# EAGLE design FAL6567f (EAGLE 7.2.0)
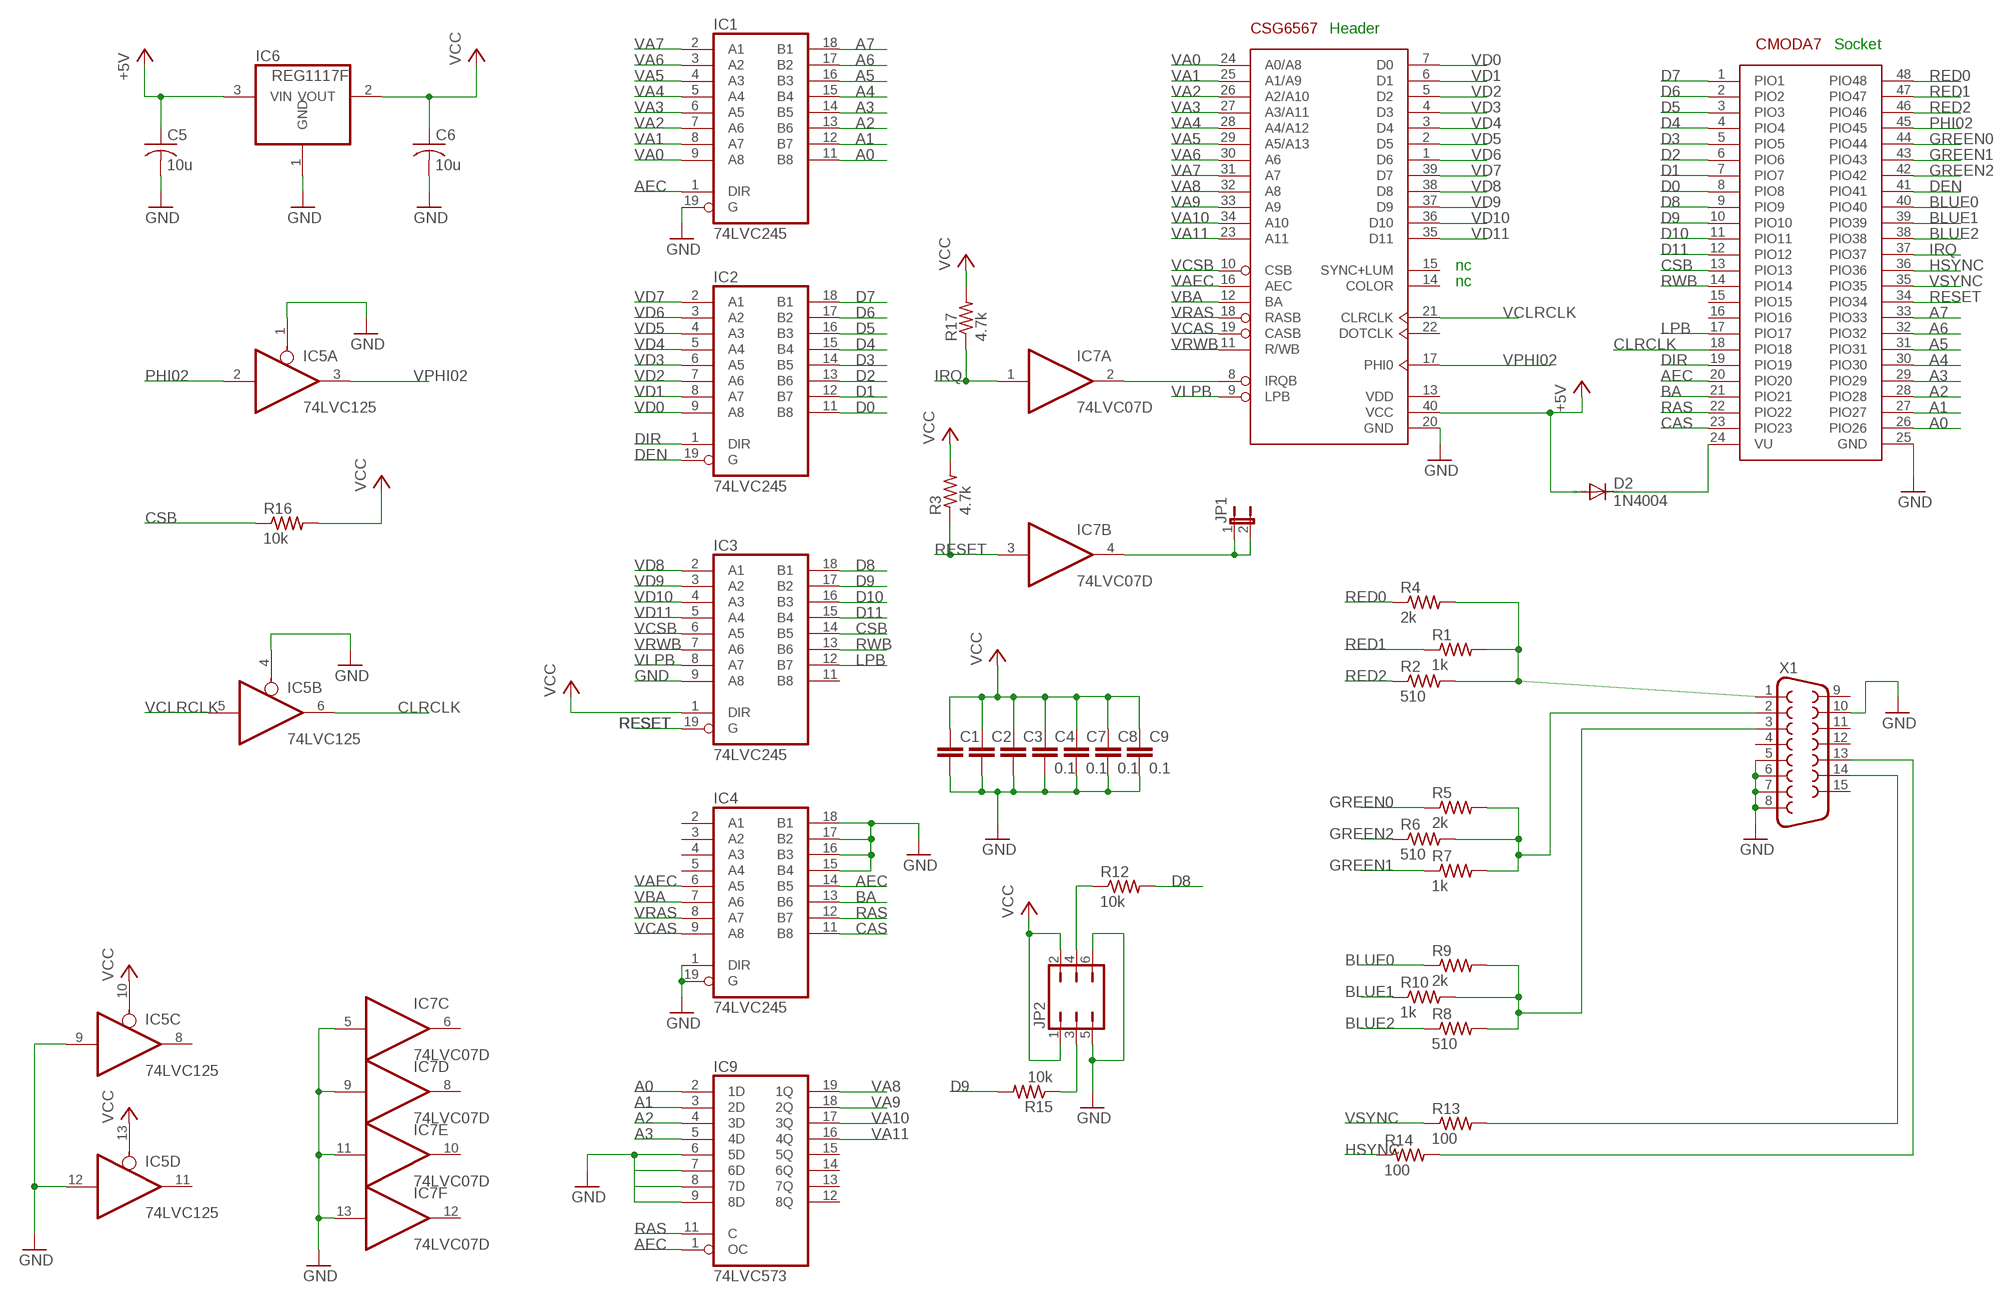
[diagram p0: schematic, sheet 1]

## Parts
C1  C-EU050-024X044  [C050-024X044]
C2  C-EU050-024X044  [C050-024X044]
C3  C-EU050-024X044  [C050-024X044]
C4  0.1  C-EU050-024X044  [C050-024X044]
C5  10u  C-USC1206  [C1206]
C6  10u  C-USC1206  [C1206]
C7  0.1  C-EU050-024X044  [C050-024X044]
C8  0.1  C-EU050-024X044  [C050-024X044]
C9  0.1  C-EU050-024X044  [C050-024X044]
D2  1N4004  [DO41-10]
IC1  74LVC245  74LS245DW  [SO20W]
IC2  74LVC245  74LS245DW  [SO20W]
IC3  74LVC245  74LS245DW  [SO20W]
IC4  74LVC245  74LS245DW  [SO20W]
IC5  74LVC125  [SO14]
IC6  REG1117F  [DD-3]
IC7  74LVC07D  74LS07D  [SO14]
IC9  74LVC573  [SO20W]
JP1  JP1E  [JP1]
JP2  JP3Q  [JP3Q]
R1  1k  R-US_0204/7  [0204/7]
R2  510  R-US_0204/7  [0204/7]
R3  4.7k  R-US_0204/7  [0204/7]
R4  2k  R-US_0204/7  [0204/7]
R5  2k  R-US_0204/7  [0204/7]
R6  510  R-US_0204/7  [0204/7]
R7  1k  R-US_0204/7  [0204/7]
R8  510  R-US_0204/7  [0204/7]
R9  2k  R-US_0204/7  [0204/7]
R10  1k  R-US_0204/7  [0204/7]
R12  10k  R-US_0204/7  [0204/7]
R13  100  R-US_0204/7  [0204/7]
R14  100  R-US_0204/7  [0204/7]
R15  10k  R-US_0204/7  [0204/7]
R16  10k  R-US_0204/7  [0204/7]
R17  4.7k  R-US_0204/7  [0204/7]
U$1  CSG6567  [DIP-40]
U$2  CMODA7  [DIL48]
X1  F15HDV  [HDF15V]

## Nets
+5V: C5.1 D2.A IC6.3(VIN) U$1.40(VCC)
A0: IC1.11(B8) IC9.2(1D) U$2.26(PIO26)
A1: IC1.12(B7) IC9.3(2D) U$2.27(PIO27)
A2: IC1.13(B6) IC9.4(3D) U$2.28(PIO28)
A3: IC1.14(B5) IC9.5(4D) U$2.29(PIO29)
A4: IC1.15(B4) U$2.30(PIO30)
A5: IC1.16(B3) U$2.31(PIO31)
A6: IC1.17(B2) U$2.32(PIO32)
A7: IC1.18(B1) U$2.33(PIO33)
AEC: IC1.1(DIR) IC4.14(B5) IC9.1(OC) U$2.20(PIO20)
BA: IC4.13(B6) U$2.21(PIO21)
BLUE0: R9.1 U$2.40(PIO40)
BLUE1: R10.1 U$2.39(PIO39)
BLUE2: R8.1 U$2.38(PIO38)
CAS: IC4.11(B8) U$2.23(PIO23)
CLRCLK: IC5.6(B:O) U$2.18(PIO18)
CSB: IC3.14(B5) R16.1 U$2.13(PIO13)
D0: IC2.11(B8) U$2.8(PIO8)
D1: IC2.12(B7) U$2.7(PIO7)
D2: IC2.13(B6) U$2.6(PIO6)
D3: IC2.14(B5) U$2.5(PIO5)
D4: IC2.15(B4) U$2.4(PIO4)
D5: IC2.16(B3) U$2.3(PIO3)
D6: IC2.17(B2) U$2.2(PIO2)
D7: IC2.18(B1) U$2.1(PIO1)
D8: IC3.18(B1) R12.2 U$2.9(PIO9)
D9: IC3.17(B2) R15.2 U$2.10(PIO10)
D10: IC3.16(B3) U$2.11(PIO11)
D11: IC3.15(B4) U$2.12(PIO12)
DEN: IC2.19(G) U$2.41(PIO41)
DIR: IC2.1(DIR) U$2.19(PIO19)
GND: C1.2 C2.2 C3.2 C4.2 C5.2 C6.2 C7.2 C8.2 C9.2 IC1.19(G) IC3.9(A8) IC4.1(DIR) IC4.15(B4) IC4.16(B3) IC4.17(B2) IC4.18(B1) IC4.19(G) IC5.1(A:OE) IC5.4(B:OE) IC5.9(C:I) IC5.12(D:I) IC6.1(GND) IC7.5(C:I) IC7.9(D:I) IC7.11(E:I) IC7.13(F:I) IC9.6(5D) IC9.9(8D) JP2.5 JP2.6 U$1.20(GND) U$2.25(GND) X1.5 X1.6 X1.7 X1.8 X1.10
GREEN0: R5.1 U$2.44(PIO44)
GREEN1: R7.1 U$2.43(PIO43)
GREEN2: R6.1 U$2.42(PIO42)
HSYNC: R14.1 U$2.36(PIO36)
IRQ: IC7.1(A:I) R17.1 U$2.37(PIO37)
LPB: IC3.12(B7) U$2.17(PIO17)
MD0: JP2.4 R12.1
MD1: JP2.3 R15.1
N$1: IC7.2(A:O) U$1.8(IRQB)
N$3: IC9.7(6D)
N$4: D2.C U$2.24(VU)
N$5: IC9.8(7D)
N$7: R1.2 R2.2 R4.2 X1.1
N$8: IC7.4(B:O) JP1.1 JP1.2
N$10: R8.2 R9.2 R10.2 X1.3
N$12: R14.2 X1.13
N$13: R13.2 X1.14
N$15: R5.2 R6.2 R7.2 X1.2
PHI02: IC5.2(A:I) U$2.45(PIO45)
RAS: IC4.12(B7) IC9.11(C) U$2.22(PIO22)
RED0: R4.1 U$2.48(PIO48)
RED1: R1.1 U$2.47(PIO47)
RED2: R2.1 U$2.46(PIO46)
RESET: IC3.19(G) IC7.3(B:I) R3.1 U$2.34(PIO34)
RWB: IC3.13(B6) U$2.14(PIO14)
VA0: IC1.9(A8) U$1.24(A0/A8)
VA1: IC1.8(A7) U$1.25(A1/A9)
VA2: IC1.7(A6) U$1.26(A2/A10)
VA3: IC1.6(A5) U$1.27(A3/A11)
VA4: IC1.5(A4) U$1.28(A4/A12)
VA5: IC1.4(A3) U$1.29(A5/A13)
VA6: IC1.3(A2) U$1.30(A6)
VA7: IC1.2(A1) U$1.31(A7)
VA8: IC9.19(1Q) U$1.32(A8)
VA9: IC9.18(2Q) U$1.33(A9)
VA10: IC9.17(3Q) U$1.34(A10)
VA11: IC9.16(4Q) U$1.23(A11)
VAEC: IC4.6(A5) U$1.16(AEC)
VBA: IC4.7(A6) U$1.12(BA)
VCAS: IC4.9(A8) U$1.19(CASB)
VCC: C1.1 C2.1 C3.1 C4.1 C6.1 C7.1 C8.1 C9.1 IC3.1(DIR) IC5.10(C:OE) IC5.13(D:OE) IC6.2(VOUT) JP2.1 JP2.2 R3.2 R16.2 R17.2
VCLRCLK: IC5.5(B:I) U$1.21(CLRCLK)
VCSB: IC3.6(A5) U$1.10(CSB)
VD0: IC2.9(A8) U$1.7(D0)
VD1: IC2.8(A7) U$1.6(D1)
VD2: IC2.7(A6) U$1.5(D2)
VD3: IC2.6(A5) U$1.4(D3)
VD4: IC2.5(A4) U$1.3(D4)
VD5: IC2.4(A3) U$1.2(D5)
VD6: IC2.3(A2) U$1.1(D6)
VD7: IC2.2(A1) U$1.39(D7)
VD8: IC3.2(A1) U$1.38(D8)
VD9: IC3.3(A2) U$1.37(D9)
VD10: IC3.4(A3) U$1.36(D10)
VD11: IC3.5(A4) U$1.35(D11)
VLPB: IC3.8(A7) U$1.9(LPB)
VPHI02: IC5.3(A:O) U$1.17(PHI0)
VRAS: IC4.8(A7) U$1.18(RASB)
VRWB: IC3.7(A6) U$1.11(R/WB)
VSYNC: R13.1 U$2.35(PIO35)
Unconnected: IC3.11(B8) IC4.2(A1) IC4.3(A2) IC4.4(A3) IC4.5(A4) IC5.8(C:O) IC5.11(D:O) IC7.6(C:O) IC7.8(D:O) IC7.10(E:O) IC7.12(F:O) IC9.12(8Q) IC9.13(7Q) IC9.14(6Q) IC9.15(5Q) U$1.14(COLOR) U$1.15(SYNC+LUM) U$1.22(DOTCLK) U$2.15(PIO15) U$2.16(PIO16) X1.4 X1.9 X1.11 X1.12 X1.15

## Notes on the sheet
- Header
- Socket
- nc
- nc

## Power pins joined to a net without a drawn wire
GND: IC1.10(GND) IC2.10(GND) IC3.10(GND) IC4.10(GND) IC5.7(P:GND) IC7.7(P:GND) IC9.10(GND)
VCC: IC1.20(VCC) IC2.20(VCC) IC3.20(VCC) IC4.20(VCC) IC5.14(P:VCC) IC7.14(P:VCC) IC9.20(VCC)
VDD: U$1.13(VDD)

## Library data of the parts
C1-C4 C7-C9 = resistor:C-EU: CAPACITOR, European symbol
C5 C6 = resistor:C-US: CAPACITOR, American symbol
D2 = diode:1N4004: DIODE general purpose rectifier, 1 A
IC1-IC4 = FT74xx:74*245: Octal BUS TRANSCEIVER, 3-state
IC5 = FT74xx:74*125: Quad bus BUFFER, 3-state
IC6 = burr-brown:REG1117: 800mA and 1A Low Dropout (LDO) Positive Regulator 1.8V, 2.5V, 2.85V, 3.3V, 5V, and Adj; MF: TEXAS INSTRUMENTS; MPN: REG1117FAKTTT; OC_FARNELL: 1296120; OC_NEWARK: 87H2562
IC7 = FT74xx:74*07: Hex BUFFER, open collector high-voltage output
IC9 = FT74xx:74*573: 8-bit D latch BUS DRIVER
JP1 = jumper:JP1E: JUMPER
JP2 = jumper:JP3Q: JUMPER
R1-R10 R12-R17 = resistor:R-US_: RESISTOR, American symbol
U$1 = 65xxx:CSG6567
U$2 = FT74xx:CMODA7
X1 = con-subd:F15: SUB-D; OC_FARNELL: unknown; OC_NEWARK: unknown

## Board
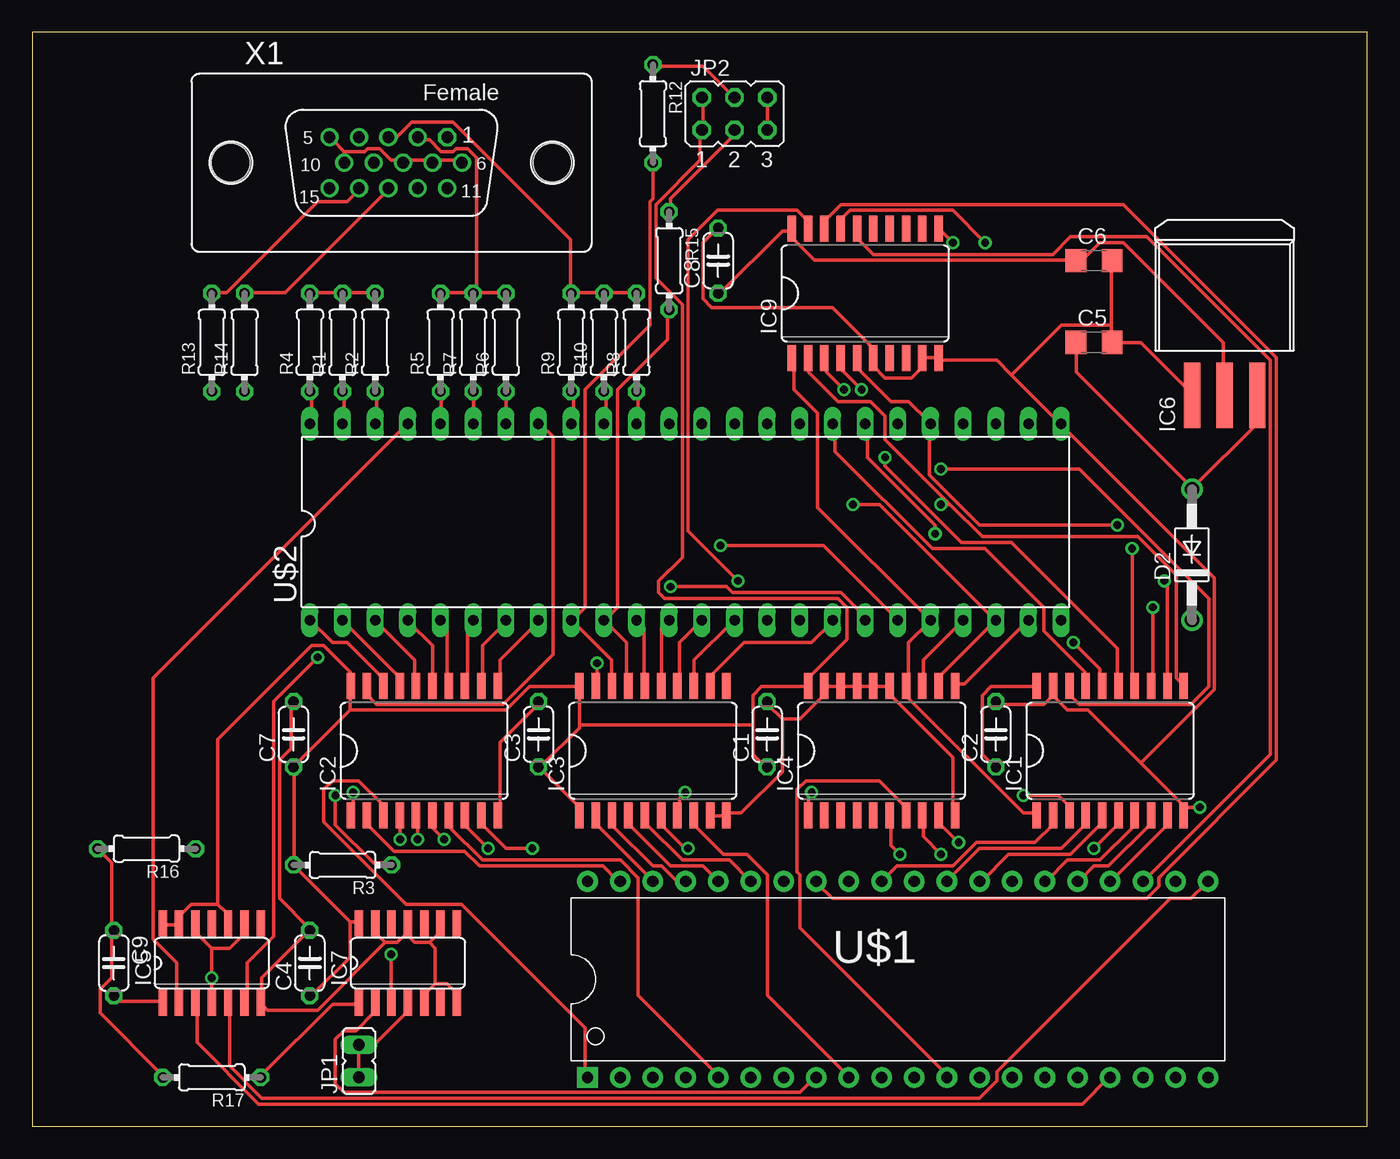
[diagram p1: board, top side]
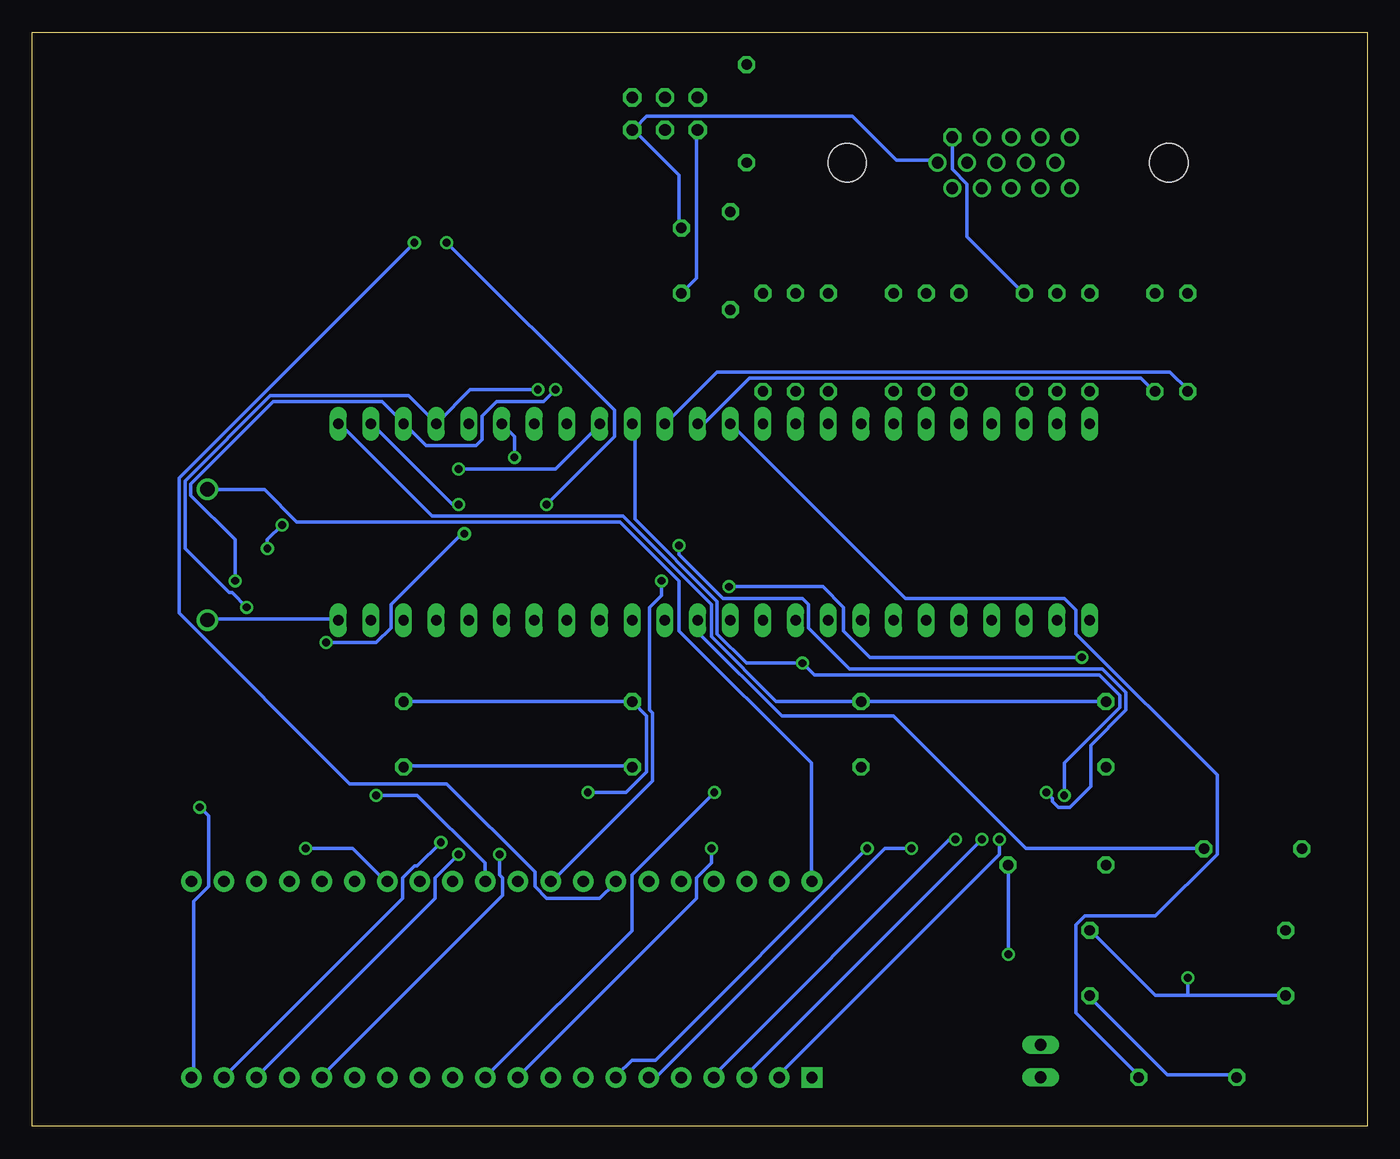
[diagram p2: board, bottom side, seen from below]

Size 103.81 x 85.08 mm. Coordinates in mm from the lower left corner, seen from the top.
Outline: 0,0 103.81,0 103.81,85.08 0,85.08 0,0
Copper layers (1*16): Top 0.035mm / dielectric 1.5mm / Bottom 0.035mm
Design rules "default": minimum track width 10mil, minimum drill 24mil, track to track 8mil, track to pad 8mil, pad to pad 8mil, via to via 8mil, smd to smd 8mil, copper to edge 40mil, drill to drill 8mil, minimum pad ring 10mil, minimum via ring 8mil, stop-mask expansion 4mil, vias tented up to drill 0mil, thermal gap 10mil

### Footprints (pad centres in the part's own frame; a part is rotated, then mirrored left to right if it is on the bottom)
C050-024X044 = drill 0.813 octagon: 1 -2.54,0; 2 2.54,0
C1206 = smd 1.6 x 1.8: 1 -1.4,0; 2 1.4,0
DO41-10 = drill 1.118: A 5.08,0; C -5.08,0
SO20W = smd 0.66 x 2.032: 1 -5.715,-5.029; 2 -4.445,-5.029; 3 -3.175,-5.029; 4 -1.905,-5.029; 5 -0.635,-5.029; 6 0.635,-5.029; 7 1.905,-5.029; 8 3.175,-5.029; 9 4.445,-5.029; 10 5.715,-5.029; 11 5.715,5.029; 12 4.445,5.029; 13 3.175,5.029; 14 1.905,5.029; 15 0.635,5.029; 16 -0.635,5.029; 17 -1.905,5.029; 18 -3.175,5.029; 19 -4.445,5.029; 20 -5.715,5.029
SO14 = smd 0.66 x 2.032: 1 -3.81,-3.073; 2 -2.54,-3.073; 3 -1.27,-3.073; 4 0,-3.073; 5 1.27,-3.073; 6 2.54,-3.073; 7 3.81,-3.073; 8 3.81,3.073; 9 2.54,3.073; 10 1.27,3.073; 11 0,3.073; 12 -1.27,3.073; 13 -2.54,3.073; 14 -3.81,3.073
DD-3 = smd 1.27 x 5.08: 1 -2.54,-7.938; 2 0,-7.938; 3 2.54,-7.938
JP1 = drill 0.914 long: 1 0,-1.27; 2 0,1.27
JP3Q = drill 0.914 octagon: 1 -2.54,-1.27; 2 -2.54,1.27; 3 0,-1.27; 4 0,1.27; 5 2.54,-1.27; 6 2.54,1.27
0204/7 = drill 0.813 octagon: 1 -3.81,0; 2 3.81,0
DIP-40 = drill 0.889 pad 1.6 square: 1 -22.86,-7.62 | drill 0.889 pad 1.6: 2 -20.32,-7.62; 3 -17.78,-7.62; 4 -15.24,-7.62; 5 -12.7,-7.62; 6 -10.16,-7.62; 7 -7.62,-7.62; 8 -5.08,-7.62; 9 -2.54,-7.62; 10 0,-7.62; 11 2.54,-7.62; 12 5.08,-7.62; 13 7.62,-7.62; 14 10.16,-7.62; 15 12.7,-7.62; 16 15.24,-7.62; 17 17.78,-7.62; 18 20.32,-7.62; 19 22.86,-7.62; 20 25.4,-7.62; 21 25.4,7.62; 22 22.86,7.62; 23 20.32,7.62; 24 17.78,7.62; 25 15.24,7.62; 26 12.7,7.62; 27 10.16,7.62; 28 7.62,7.62; 29 5.08,7.62; 30 2.54,7.62; 31 0,7.62; 32 -2.54,7.62; 33 -5.08,7.62; 34 -7.62,7.62; 35 -10.16,7.62; 36 -12.7,7.62; 37 -15.24,7.62; 38 -17.78,7.62; 39 -20.32,7.62; 40 -22.86,7.62
DIL48 = drill 0.813 long: 1 -29.21,-7.62; 2 -26.67,-7.62; 3 -24.13,-7.62; 4 -21.59,-7.62; 5 -19.05,-7.62; 6 -16.51,-7.62; 7 -13.97,-7.62; 8 -11.43,-7.62; 9 -8.89,-7.62; 10 -6.35,-7.62; 11 -3.81,-7.62; 12 -1.27,-7.62; 13 1.27,-7.62; 14 3.81,-7.62; 15 6.35,-7.62; 16 8.89,-7.62; 17 11.43,-7.62; 18 13.97,-7.62; 19 16.51,-7.62; 20 19.05,-7.62; 21 21.59,-7.62; 22 24.13,-7.62; 23 26.67,-7.62; 24 29.21,-7.62; 25 29.21,7.62; 26 26.67,7.62; 27 24.13,7.62; 28 21.59,7.62; 29 19.05,7.62; 30 16.51,7.62; 31 13.97,7.62; 32 11.43,7.62; 33 8.89,7.62; 34 6.35,7.62; 35 3.81,7.62; 36 1.27,7.62; 37 -1.27,7.62; 38 -3.81,7.62; 39 -6.35,7.62; 40 -8.89,7.62; 41 -11.43,7.62; 42 -13.97,7.62; 43 -16.51,7.62; 44 -19.05,7.62; 45 -21.59,7.62; 46 -24.13,7.62; 47 -26.67,7.62; 48 -29.21,7.62
HDF15V = drill 0.9 octagon: 1 4.329,1.98 | drill 0.9: 2 2.043,1.98; 3 -0.243,1.98; 4 -2.529,1.98; 5 -4.815,1.98; 6 5.472,0; 7 3.186,0; 8 0.9,0; 9 -1.386,0; 10 -3.672,0; 11 4.329,-1.98; 12 2.043,-1.98; 13 -0.243,-1.98; 14 -2.529,-1.98; 15 -4.815,-1.98 | hole 3: -12.5,0; 12.5,0

### Placement (x,y rotation side)
C1  57.15,30.48 90 top
C2  74.93,30.48 90 top
C3  39.37,30.48 90 top
C4  21.59,12.7 90 top
C5  82.55,60.96 0 top
C6  82.55,67.31 0 top
C7  20.32,30.48 90 top
C8  53.34,67.31 90 top
C9  6.35,12.7 270 top
D2  90.17,44.45 90 top
DRILEGEND  [DRILEGEND]  0,-7.62 0 top  (outside the outline)
IC1  83.82,29.21 0 top
IC2  30.48,29.21 0 top
IC3  48.26,29.21 0 top
IC4  66.04,29.21 0 top
IC5  13.97,12.7 0 top
IC6  92.71,64.77 0 top
IC7  29.21,12.7 0 top
IC9  64.77,64.77 0 top
JP1  25.4,5.08 0 top
JP2  54.61,78.74 0 top
R1  24.13,60.96 90 top
R2  26.67,60.96 90 top
R3  24.13,20.32 180 top
R4  21.59,60.96 90 top
R5  31.75,60.96 90 top
R6  36.83,60.96 90 top
R7  34.29,60.96 90 top
R8  46.99,60.96 90 top
R9  41.91,60.96 90 top
R10  44.45,60.96 90 top
R12  48.26,78.74 270 top
R13  13.97,60.96 90 top
R14  16.51,60.96 90 top
R15  49.53,67.31 270 top
R16  8.89,21.59 180 top
R17  13.97,3.81 180 top
U$1  66.04,11.43 0 top
U$2  50.8,46.99 0 top
X1  27.94,74.93 0 top

### Tracks (layer width: path | path; a pad name or v marks a point on that pad's centre or on a via)
+5V
  Top 0.254: C5.1 81.18,60.94 81.18,58.65 90.09,49.73 D2.A 90.32,49.73 95.12,54.53 95.12,56.82 IC6.3
  Bottom 0.254: U$1.40 43.23,19.1 43.23,28.25 53.52,38.53 53.52,42.42 58.09,46.99 83.24,46.99 85.75,49.51 90.09,49.51 D2.A
A0  (via drill 0.61)
  Top 0.254: 71.35,48.36 73.86,45.85 85.98,45.85 88.95,42.88 88.95,34.87 89.41,34.42 IC1.11 | 71.35,48.36 66.32,53.39 66.32,55.22 65.18,56.36 62.66,56.36 60.38,58.65 60.38,59.56 IC9.2 | 71.35,48.36 v70.66,48.36
  Bottom 0.254: v70.66,48.36 71.12,48.36 77.29,54.53 U$2.26
A1  (via drill 0.61)
  Top 0.254: IC1.12 88.27,42.19 v88.04,42.42 | v63.12,57.28 61.75,58.65 61.75,59.56 IC9.3
  Bottom 0.254: v88.04,42.42 88.04,45.62 91.47,49.05 91.47,49.96 85.07,56.36 76.61,56.36 75.01,54.76 U$2.27 74.78,54.53 73.18,52.93 69.29,52.93 68.83,53.39 68.83,55.22 67.69,56.36 64.03,56.36 v63.12,57.28
A2  (via drill 0.61)
  Top 0.254: v87.12,40.36 87.12,34.42 IC1.13 | v64.49,57.28 62.89,58.88 62.89,59.56 IC9.4
  Bottom 0.254: v87.12,40.36 88.27,41.5 88.49,41.5 91.92,44.93 91.92,50.19 85.29,56.82 74.55,56.82 72.49,54.76 U$2.28 72.26,54.76 69.75,57.28 v64.49,57.28
A3  (via drill 0.61)
  Top 0.254: v85.52,44.93 85.52,34.42 IC1.14 | v84.38,46.76 73.64,46.76 69.75,50.65 69.75,54.53 U$2.29 69.75,54.76 68.15,56.36 66.78,56.36 64.26,58.88 64.26,59.56 IC9.5
  Bottom 0.254: v85.52,44.93 85.52,45.62 v84.38,46.76
A4  (via drill 0.61)
  Top 0.254: v66.32,52.02 66.32,51.33 72.26,45.39 76.15,45.39 84.38,37.16 84.38,34.42 IC1.15
  Bottom 0.254: v66.32,52.02 66.32,53.62 U$2.30
A5  (via drill 0.61)
  Top 0.254: v80.95,37.62 83.01,35.56 83.01,34.42 IC1.16 | v70.21,46.08 70.21,46.76 64.95,52.02 64.95,54.53 U$2.31
  Bottom 0.254: v80.95,37.62 77.06,37.62 75.92,38.76 75.92,40.59 70.43,46.08 v70.21,46.08
A6
  Top 0.254: IC1.17 81.86,34.42 81.86,35.33 78.66,38.53 78.66,40.36 74.09,44.93 69.98,44.93 62.43,52.48 62.43,54.53 U$2.32
A7  (via drill 0.61)
  Top 0.254: v70.66,51.11 81.41,51.11 91.47,41.05 91.47,34.19 90.09,32.82 81.41,32.82 80.72,33.5 80.72,34.19 IC1.18
  Bottom 0.254: v70.66,51.11 63.12,51.11 59.69,54.53 U$2.33
AEC
  Top 0.254: IC1.1 77.98,24.36 77.06,24.36 68.15,33.27 68.15,34.19 IC4.14 68.15,34.42 68.15,37.62 69.75,39.22 U$2.20 69.75,39.45 61.06,48.13 61.06,55.45 59.23,57.28 59.23,59.56 IC9.1
BA
  Top 0.254: IC4.13 69.29,34.42 69.29,36.25 72.26,39.22 U$2.21
BLUE0
  Top 0.254: U$2.40 42.09,54.76 42.09,57.05 R9.1
BLUE1
  Top 0.254: U$2.39 44.6,54.76 44.6,57.05 R10.1
BLUE2
  Top 0.254: U$2.38 47.12,54.76 47.12,57.05 R8.1
CAS
  Top 0.254: IC4.11 71.81,34.42 72.49,34.42 77.29,39.22 U$2.23
CLRCLK  (via drill 0.61)
  Top 0.254: v22.2,36.47 18.77,33.05 18.77,14.76 16.71,12.7 16.71,9.73 IC5.6 | v49.63,41.96 53.98,41.96 54.43,41.5 62.89,41.5 64.95,39.45 U$2.18
  Bottom 0.254: v22.2,36.47 38.66,36.47 40.72,38.53 40.72,40.36 42.32,41.96 v49.63,41.96
CSB
  Top 0.254: U$2.13 50.32,37.62 50.32,34.42 IC3.14
  Bottom 0.254: R16.1 12.83,21.61 26.54,21.61 36.83,31.9 45.52,31.9 51.92,38.3 51.92,39.22 U$2.13
D0
  Top 0.254: IC2.11 36.37,34.42 36.37,36.25 39.34,39.22 U$2.8
D1
  Top 0.254: IC2.12 35,34.42 35,37.39 36.83,39.22 U$2.7
D2
  Top 0.254: IC2.13 33.86,34.42 33.86,38.99 34.09,39.22 U$2.6
D3
  Top 0.254: IC2.14 32.26,34.42 32.26,38.76 31.8,39.22 U$2.5
D4
  Top 0.254: IC2.15 31.11,37.39 29.29,39.22 U$2.4
D5
  Top 0.254: IC2.16 29.74,34.42 29.74,36.25 26.77,39.22 U$2.3
D6
  Top 0.254: IC2.17 28.37,34.42 28.37,35.1 24.26,39.22 U$2.2
D7
  Top 0.254: U$2.1 23.34,37.62 24.49,37.62 27.23,34.87 27.23,34.42 IC2.18
D8
  Top 0.254: IC3.18 45.06,34.42 45.06,36.25 42.09,39.22 U$2.9 42.09,39.45 43,40.36 43,57.28 48.03,62.31 48.03,71.91 48.26,72.14 R12.2
D9
  Top 0.254: IC3.17 46.2,34.42 46.2,37.62 U$2.10 44.6,39.45 45.52,40.36 45.52,57.28 49.4,61.16 49.4,63.45 R15.2
D10
  Top 0.254: IC3.16 47.57,34.42 47.57,38.76 47.12,39.22 U$2.11
D11
  Top 0.254: IC3.15 48.95,34.42 48.95,38.76 49.4,39.22 U$2.12
DEN
  Top 0.254: IC2.19 26.09,34.19 26.09,33.5 26.77,32.82 36.6,32.82 40.49,36.7 40.49,53.62 39.57,54.53 U$2.41
DIR  (via drill 0.61)
  Top 0.254: v24.94,25.96 24.94,24.36 IC2.1 | v53.52,45.16 61.52,45.16 U$2.19
  Bottom 0.254: v24.94,25.96 24.49,25.5 24.49,25.27 24.03,24.82 23.11,24.82 21.51,26.42 21.51,29.62 18.77,32.36 18.77,33.73 20.6,35.56 40.26,35.56 43.46,38.76 43.46,40.59 43.92,41.05 50.09,41.05 53.52,44.48 v53.52,45.16
GND  (via drill 0.61)
  Top 0.254: IC3.9 52.83,24.13 53.98,24.13 IC3.10 53.98,24.36 55.12,24.36 58.32,27.56 58.32,31.67 | v60.6,25.96 60.38,25.73 60.38,24.36 IC4.1 | 58.32,31.67 57.17,32.82 C1.2 | 65.41,34.19 64.26,34.19 IC4.17 64.03,34.19 62.89,34.19 IC4.18 62.66,34.19 61.75,34.19 IC4.19 61.52,34.19 61.52,33.5 59.69,31.67 58.32,31.67 | 65.41,34.19 66.55,34.19 IC4.15 66.78,34.19 66.78,33.5 71.58,28.7 71.58,24.36 IC4.10 | 65.41,34.19 IC4.16 | 79.35,33.5 79.35,34.19 IC1.19 79.35,33.5 | 79.35,33.5 78.66,32.82 75.01,32.82 C2.2 | 89.41,24.82 89.41,25.04 86.21,28.25 | 89.41,24.82 89.41,24.36 IC1.10 89.41,24.82 | 86.21,28.25 82.09,32.36 80.49,32.36 79.35,33.5 | 89.41,24.82 v90.78,24.82 | IC2.10 36.37,24.36 36.37,29.84 39.34,32.82 C3.2 | 31.34,11.1 30.66,10.41 30.66,9.73 IC7.5 | 31.34,11.1 32.26,11.1 32.94,10.41 32.94,9.73 IC7.7 | 27.46,14.3 26.77,14.99 26.77,15.67 IC7.13 | 27.46,14.3 28.37,14.3 29.06,14.99 | 29.06,14.99 29.06,15.67 IC7.11 29.06,14.99 | 30.89,14.3 31.57,14.99 31.57,15.67 IC7.9 | 30.89,14.3 29.74,14.3 29.06,14.99 | 31.34,11.1 31.34,13.84 30.89,14.3 | 13.97,13.84 v13.97,11.56 IC5.4 | 13.97,13.84 12.83,14.99 12.83,15.67 IC5.12 | 13.97,13.84 15.34,13.84 16.48,14.99 16.48,15.67 IC5.9 | IC5.1 10.08,9.73 6.66,9.73 6.43,9.96 C9.2 | 27.46,14.3 22.2,9.04 18.31,9.04 17.86,9.5 IC5.7 17.86,9.73 17.86,11.56 21.51,15.21 C4.2 21.51,15.44 19.23,17.73 19.23,28.47 20.14,29.39 20.14,32.82 C7.2 | 76.15,58.42 75.01,59.56 70.66,59.56 IC9.10 70.43,59.79 69.29,59.79 IC9.9 69.06,59.56 69.06,58.88 68.38,58.19 66.32,58.19 65.41,59.11 IC9.6 65.41,60.48 62.2,63.68 52.83,63.68 52.15,64.36 52.15,68.71 53.29,69.85 C8.2
  Top 0.254: 76.15,58.42 79.81,54.76 U$2.25 80.04,54.53 91.92,42.65 91.92,33.96 86.21,28.25 | 83.92,62.31 83.92,67.11 C6.2 | 83.92,62.31 83.92,61.16 C5.2 84.15,60.94 86.21,60.94 90.09,57.05 IC6.1 | 76.15,58.42 80.04,62.31 83.92,62.31 | 24.26,75.79 24.26,75.11 X1.10 | 24.26,75.79 23.34,76.71 X1.5 | X1.6 33.4,75.11 31.34,75.11 X1.7 31.11,75.11 29.06,75.11 X1.8 28.83,75.11 27.91,75.11 27,76.02 26.09,76.02 25.86,75.79 24.26,75.79 | JP2.6 57.17,79.91 57.17,77.62 JP2.5
  Bottom 0.254: v60.6,25.96 57.63,25.96 56.03,27.56 56.03,31.9 C1.2 57.17,33.05 74.78,33.05 C2.2 | v90.78,24.82 90.09,24.13 90.09,18.64 91.24,17.5 91.24,4.01 U$1.20 | C7.2 20.37,33.05 39.34,33.05 C3.2 39.57,33.05 45.97,33.05 51,38.08 51,40.59 57.86,47.45 72.72,47.45 79.81,54.53 U$2.25 | 13.97,10.18 16.48,10.18 21.51,15.21 C4.2 | 13.97,10.18 6.43,10.18 C9.2 | 13.97,10.18 v13.97,11.56 | C8.2 53.52,69.85 53.52,73.96 56.95,77.39 JP2.5 56.95,77.62 56.03,78.54 40.03,78.54 36.6,75.11 33.63,75.11 X1.6
GREEN0
  Top 0.254: U$2.44 31.8,54.76 31.8,57.05 R5.1
GREEN1
  Top 0.254: U$2.43 34.31,54.76 34.31,57.05 R7.1
GREEN2
  Top 0.254: R6.1 U$2.42
HSYNC
  Bottom 0.254: U$2.36 51.92,54.76 51.46,54.76 48.03,58.19 17.63,58.19 16.71,57.28 R14.1
IRQ
  Top 0.254: IC7.1 25.4,9.5 23.34,9.5 17.86,4.01 R17.1
  Bottom 0.254: U$2.37 49.4,54.53 35.92,41.05 23.57,41.05 22.66,40.13 22.66,38.3 11.68,27.33 11.68,21.16 16.48,16.36 21.97,16.36 22.66,15.67 22.66,8.81 17.86,4.01 R17.1
LPB
  Top 0.254: IC3.12 52.83,34.42 52.83,35.1 55.35,37.62 60.6,37.62 62.2,39.22 U$2.17
MD0
  Top 0.254: R12.1 48.26,82.42 52.15,82.42 54.43,80.14 JP2.4
MD1
  Top 0.254: R15.1 49.63,71.22 49.63,72.14 54.43,76.94 54.43,77.39 JP2.3
N$1
  Top 0.254: IC7.2 26.54,9.5 26.54,8.81 25.17,7.44 24.26,7.44 23.57,6.76 23.57,3.33 24.26,2.64 59.69,2.64 60.83,3.79 U$1.8
N$4
  Bottom 0.254: U$2.24 80.04,39.45 90.09,39.45 D2.C
N$7
  Top 0.254: R4.2 21.74,64.82 24.03,64.82 R1.2 24.26,64.82 26.54,64.82 R2.2
  Bottom 0.254: X1.1 32.26,76.71 32.26,74.42 31.11,73.28 31.11,69.16 26.77,64.82 R2.2
N$8
  Top 0.254: IC7.4 29.06,9.5 29.06,8.81 26.77,6.53 25.4,6.53 JP1.2 JP1.1
N$10
  Top 0.254: R8.2 46.89,64.82 44.6,64.82 R10.2 44.37,64.82 42.09,64.82 R9.2 41.86,64.82 41.86,68.94 32.72,78.08 29.52,78.08 28.37,76.94 27.91,76.94 X1.3
N$12
  Top 0.254: R14.2 16.71,64.82 19.68,64.82 27.69,72.82 X1.13
N$13
  Top 0.254: R13.2 13.97,64.82 15.11,64.82 22.2,71.91 24.49,71.91 25.4,72.82 X1.14
N$15
  Top 0.254: R5.2 31.8,64.82 34.09,64.82 R7.2 | 34.54,64.82 34.31,64.82 R7.2 | 34.54,64.82 36.83,64.82 R6.2 | 34.54,64.82 34.54,75.34 33.86,76.02 32.94,76.02 32.72,75.79 31.8,75.79 30.89,76.71 30.2,76.71 X1.2 | 34.54,64.82 R7.2
PHI02
  Top 0.254: IC5.2 11.23,9.73 11.23,12.7 9.4,14.53 9.4,34.87 29.06,54.53 U$2.45
RAS  (via drill 0.61)
  Top 0.254: IC4.12 70.66,34.42 70.66,35.1 U$2.22 74.78,39.45 65.86,48.36 v63.8,48.36 | v71.58,68.71 IC9.11
  Bottom 0.254: v71.58,68.71 58.55,55.68 58.55,53.62 v63.8,48.36
RED0
  Top 0.254: U$2.48 21.74,54.76 21.74,57.05 R4.1
RED1
  Top 0.254: U$2.47 24.26,54.76 24.26,57.05 R1.1
RED2
  Top 0.254: U$2.46 26.77,54.76 26.77,57.05 R2.1
RESET  (via drill 0.61)
  Top 0.254: v27.91,13.39 27.91,9.73 IC7.3 | v43.92,36.02 43.92,34.42 IC3.19 | v23.57,25.73 23.57,23.44 26.54,20.47 27.91,20.47 R3.1
  Bottom 0.254: v27.91,13.39 27.91,20.24 R3.1 | U$2.34 56.95,54.53 56.95,47.22 50.55,40.82 50.55,38.3 48.26,36.02 v43.92,36.02 43,35.1 20.83,35.1 19.23,33.5 19.23,32.59 23.57,28.25 v23.57,25.73
RWB
  Top 0.254: IC3.13 51.46,34.42 51.46,36.25 54.43,39.22 U$2.14
VA0
  Top 0.254: IC1.9 88.27,23.44 83.92,19.1 U$1.24
VA1
  Top 0.254: IC1.8 86.89,24.13 86.89,23.44 83.69,20.24 82.55,20.24 81.41,19.1 U$1.25
VA2
  Top 0.254: IC1.7 85.52,24.13 85.52,23.22 83.01,20.7 80.49,20.7 78.89,19.1 U$1.26
VA3  (via drill 0.61)
  Top 0.254: v82.55,21.61 84.38,23.44 84.38,24.13 IC1.6
  Bottom 0.254: v82.55,21.61 78.89,21.61 76.38,19.1 U$1.27
VA4
  Top 0.254: IC1.5 83.01,24.13 83.01,23.44 80.72,21.16 75.92,21.16 73.86,19.1 U$1.28
VA5
  Top 0.254: IC1.4 81.86,24.13 81.86,23.44 80.04,21.61 73.64,21.61 71.12,19.1 U$1.29
VA6  (via drill 0.61)
  Top 0.254: v77.06,25.73 79.81,25.73 80.49,25.04 80.49,24.36 IC1.3
  Bottom 0.254: v77.06,25.73 73.86,25.73 68.61,20.47 68.61,19.1 U$1.30
VA7
  Top 0.254: U$1.31 67.23,20.24 71.58,20.24 73.41,22.07 77.98,22.07 79.35,23.44 79.35,24.13 IC1.2
VA8  (via drill 0.61)
  Top 0.254: v54.89,42.42 51,46.3 51,68.94 53.29,71.22 59.46,71.22 60.15,70.54 60.15,69.85 IC9.19
  Bottom 0.254: v54.89,42.42 54.89,41.28 55.8,40.36 55.8,32.36 55.57,32.13 55.57,26.87 63.35,19.1 U$1.32
VA9
  Top 0.254: IC9.18 61.75,69.85 61.75,70.54 62.89,71.68 84.84,71.68 96.72,59.79 96.72,28.47 87.58,19.33 87.58,18.64 86.67,17.73 62.2,17.73 61.06,18.87 U$1.33
VA10  (via drill 0.61)
  Top 0.254: v74.09,68.71 71.58,71.22 63.58,71.22 62.89,70.54 62.89,69.85 IC9.17
  Bottom 0.254: v74.09,68.71 92.38,50.42 92.38,39.9 79.12,26.64 71.58,26.64 64.72,19.79 64.72,18.64 63.8,17.73 59.69,17.73 58.55,18.87 U$1.34
VA11
  Top 0.254: IC9.16 64.26,69.62 64.26,68.94 65.41,67.79 79.35,67.79 80.72,69.16 86.67,69.16 96.27,59.56 96.27,28.93 86.44,19.1 U$1.23
VAEC  (via drill 0.61)
  Top 0.254: v67.46,21.16 66.78,21.84 66.78,24.13 IC4.6
  Bottom 0.254: v67.46,21.16 67.46,19.56 67.23,19.33 67.23,17.96 81.18,4.01 U$1.16
VBA
  Top 0.254: IC4.7 67.92,24.36 67.92,24.82 65.86,26.87 60.15,26.87 59.46,26.19 59.46,19.79 59.69,19.56 59.69,15.44 71.12,4.01 U$1.12
VCAS  (via drill 0.61)
  Top 0.254: v72.03,22.07 70.66,23.44 70.66,24.13 IC4.9
  Bottom 0.254: v72.03,22.07 73.86,20.24 74.09,20.24 75.01,19.33 75.01,17.73 88.72,4.01 U$1.19
VCC
  Top 0.254: JP2.2 52.15,79.91 52.15,77.62 JP2.1 51.92,77.39 51.92,75.11 48.49,71.68 48.49,65.96 50.55,63.91 50.55,44.25 48.72,42.42 48.72,41.5 49.17,41.05 62.66,41.05 63.35,40.36 63.35,37.85 60.38,34.87 60.38,34.42 IC4.20 60.15,34.19 56.72,34.19 56.03,33.5 56.03,31.22 | C8.1 53.52,64.82 58.32,69.62 59,69.62 IC9.20 59.23,69.62 59.23,68.94 60.83,67.33 80.95,67.33 C6.1 81.18,67.33 81.64,67.33 83.01,68.71 84.84,68.71 92.61,60.94 92.61,57.05 IC6.2 | IC1.20 77.98,34.19 74.55,34.19 73.86,33.5 73.86,28.93 74.78,28.02 C2.1 | 56.03,31.22 56.03,28.93 56.95,28.02 C1.1 | IC3.1 42.55,24.82 39.57,27.79 C3.1 39.57,28.02 42.55,30.99 42.55,31.22 | 42.55,31.22 42.55,34.19 | 42.55,31.22 56.03,31.22 | 24.71,15.9 25.4,15.9 IC7.14 | 24.71,15.9 20.37,20.24 R3.2 20.37,20.47 20.37,27.79 C7.1 20.37,28.02 24.71,32.36 | IC5.14 10.31,15.67 11.23,15.67 IC5.13 11.45,15.9 11.45,16.36 12.37,17.27 14.43,17.27 | 14.43,17.27 15.11,16.59 15.11,15.9 IC5.10 | 24.71,32.36 24.71,34.19 IC2.20 24.71,34.42 24.71,35.33 22.66,37.39 21.74,37.39 14.43,30.07 14.43,17.27 | R16.2 6.2,20.47 6.2,15.44 C9.1 6.2,15.21 6.2,11.56 5.28,10.64 5.28,8.81 10.08,4.01 R17.2 | 24.71,15.9 24.71,13.16 21.74,10.18 C4.1 | 42.55,34.19 38.66,34.19 36.83,32.36 24.71,32.36 | 42.55,34.19 IC3.20
  Bottom 0.254: C8.1 52.15,65.96 52.15,77.39 JP2.1 | C2.1 74.78,28.02 57.17,28.02 C1.1 | R17.2 10.31,4.01 15.57,4.01 21.51,9.96 C4.1
VCLRCLK
  Top 0.254: IC5.5 15.34,9.5 15.34,4.7 17.86,2.18 73.64,2.18 75.01,3.56 75.01,4.24 88.49,17.73 90.09,17.73 91.24,18.87 U$1.21
VCSB  (via drill 0.61)
  Top 0.254: v51,21.61 50.77,21.61 48.95,23.44 48.95,24.13 IC3.6
  Bottom 0.254: v51,21.61 51,20.47 52.15,19.33 52.15,17.73 65.86,4.01 U$1.10
VD0  (via drill 0.61)
  Top 0.254: v38.89,21.61 36.83,21.61 35,23.44 35,24.13 IC2.9
  Bottom 0.254: v38.89,21.61 55.35,5.16 57.17,5.16 58.32,4.01 U$1.7
VD1  (via drill 0.61)
  Top 0.254: v35.46,21.61 33.86,23.22 33.86,24.13 IC2.8
  Bottom 0.254: v35.46,21.61 37.52,21.61 55.12,4.01 55.8,4.01 U$1.6
VD2
  Top 0.254: IC2.7 32.49,24.13 32.49,23.22 35,20.7 45.74,20.7 47.12,19.33 47.12,10.18 53.29,4.01 U$1.5
VD3  (via drill 0.61)
  Top 0.254: IC2.6 31.11,23.22 v32.03,22.3
  Bottom 0.254: v32.03,22.3 32.49,22.3 50.77,4.01 U$1.4
VD4  (via drill 0.61)
  Top 0.254: v29.97,22.3 29.97,24.13 IC2.5
  Bottom 0.254: v29.97,22.3 48.26,4.01 U$1.3
VD5  (via drill 0.61)
  Top 0.254: v28.6,22.3 28.6,24.13 IC2.4
  Bottom 0.254: v28.6,22.3 28.6,21.16 45.74,4.01 U$1.2
VD6
  Top 0.254: IC2.3 27.23,24.36 27.23,25.04 25.4,26.87 23.34,26.87 22.66,26.19 22.66,23.67 29.06,17.27 33.4,17.27 43,7.67 43,4.01 U$1.1
VD7
  Top 0.254: IC2.2 26.09,24.13 26.09,23.44 28.14,21.39 33.63,21.39 34.77,20.24 44.37,20.24 45.52,19.1 U$1.39
VD8
  Top 0.254: IC3.2 43.92,24.13 43.92,23.44 48.26,19.1 U$1.38
VD9
  Top 0.254: IC3.3 45.29,24.13 45.29,23.22 48.26,20.24 48.95,20.24 50.09,19.1 50.77,19.1 U$1.37
VD10
  Top 0.254: U$1.36 52.15,20.24 49.63,20.24 46.43,23.44 46.43,24.13 IC3.4
VD11
  Top 0.254: IC3.5 47.8,24.13 47.8,23.44 50.55,20.7 54.2,20.7 55.8,19.1 U$1.35
VLPB
  Top 0.254: IC3.8 51.46,24.13 51.46,23.44 53.75,21.16 55.57,21.16 57.17,19.56 57.17,10.18 63.35,4.01 U$1.9
VPHI02
  Top 0.254: IC5.3 12.83,9.5 12.83,6.53 17.63,1.73 81.64,1.73 83.69,3.79 U$1.17
VRAS  (via drill 0.61)
  Top 0.254: v70.66,21.16 69.29,22.53 69.29,24.13 IC4.8
  Bottom 0.254: v70.66,21.16 72.49,19.33 72.49,17.73 86.21,4.01 U$1.18
VRWB  (via drill 0.61)
  Top 0.254: v50.77,25.96 50.32,25.5 50.32,24.36 IC3.7
  Bottom 0.254: v50.77,25.96 57.17,19.56 57.17,15.21 U$1.11
VSYNC
  Bottom 0.254: U$2.35 54.43,54.76 50.55,58.65 15.34,58.65 13.97,57.28 R13.1

### Text on the board
DrillLegend: LAYER-STACK
DrillLegend_01-16: 01-16
DrillLegend_01-20: 01-20